# EasyEDA schematic LcdNodes-Building-Block-LocoNet-Interface.json
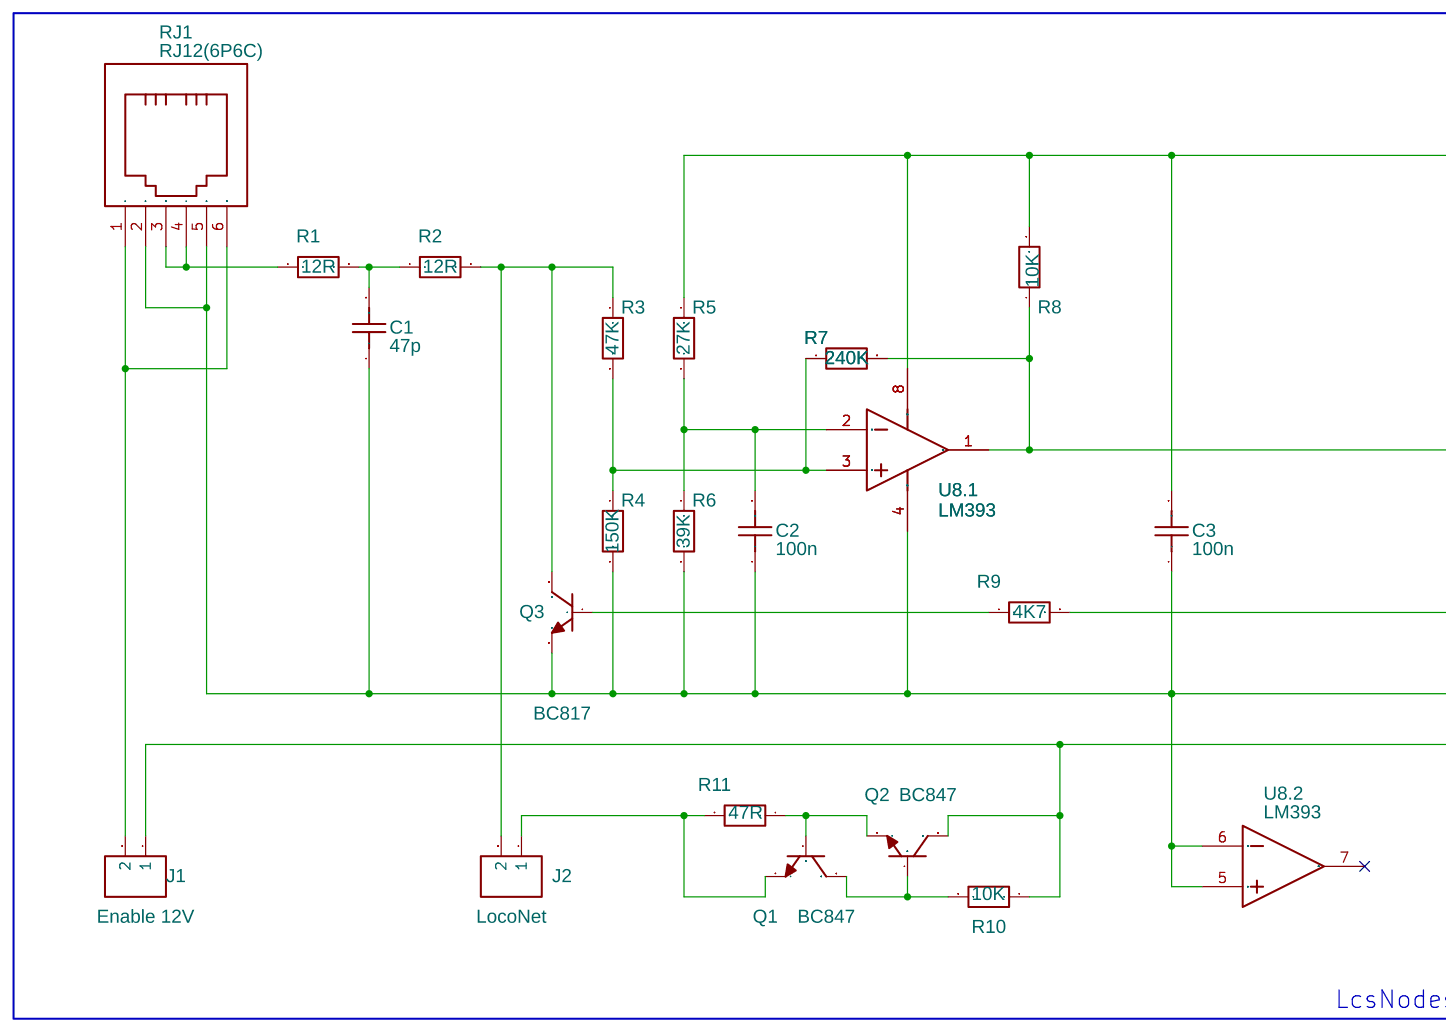
[diagram p0: schematic sheet]

## Parts
C1  47p  [C1206]
C2  100n  [C1206]
C3  100n  [C1206]
J1  Enable 12V  [HDR-M-2.54_1X2]
J2  LocoNet  [HDR-M-2.54_1X2]
Q1  BC847  [SOT-323-3_L2.0-W1.3-P1.30-LS2.1-BR]
Q2  BC847  [SOT-323-3_L2.0-W1.3-P1.30-LS2.1-BR]
Q3  BC817  [SOT-23-3_L2.9-W1.3-P1.90-LS2.4-BR]
R1  12R  [R1206]
R2  12R  [R1206]
R3  47K  [R1206]
R4  150K  [R1206]
R5  27K  [R1206]
R6  39K  [R1206]
R7  240K  [R1206]
R8  10K  [R1206]
R9  4K7  [R1206]
R10  10K  [R1206]
R11  47R  [R1206]
RJ1  RJ12(6P6C)  [RJ12-TH_6P6C]
U8  LM393  [SOIC-8_L4.9-W3.9-P1.27-LS6.0-BL]  (sections 1,2)

## Library data of the parts
C1-C3 = CT41G-1206-X5R-50V-10UF-M(N): Supplier: LCSC; Supplier Part: C9900007291; Manufacturer: null; Manufacturer Part: CT41G-1206-X5R-50V-10uF-M(N); link: https://atta.szlcsc.comnull; JLCPCB Part Class: Extended Part; Contributor: lcsc
J1 J2 = HDR-M-2.54_1x2: Supplier Part: C124375; Supplier: LCSC; Contributor: LCEDA_Lib
Q1 Q2 = BC847CW-QBC847CW-QXX: Supplier: LCSC; Supplier Part: C5182829; Manufacturer: Nexperia(安世); link: https://atta.szlcsc.com/upload/public/pdf/source/20220920/079F28AA67300DB8DEDEEFA28BB33B43.pdf; Contributor: lcsc; JLCPCB Part Class: Extended Part
Q3 = BC817-40: Supplier: LCSC; Manufacturer: Hottech(合科泰); Contributor: LCSC; Supplier Part: C181151; JLCPCB Part Class: Extended Part
R1-R11 = HVF1206T5002FET: Supplier: LCSC; Supplier Part: C4087637; Manufacturer: Ohmite; link: https://atta.szlcsc.comnull; Contributor: lcsc
RJ1 = RJ12(6P6C): Contributor: yulin0826
U8 = LM393ADRE4: Supplier: LCSC; Supplier Part: C3659061; Manufacturer: TI(德州仪器); link: https://atta.szlcsc.com/upload/public/pdf/source/20230221/4AD22C75DCC6447290BC7CE521BA2EAE.pdf; subpart_no: 1

## Nets
GND: C1.1 C2.1 C3.1 Q3.2 R4.2 R6.2 RJ1.2 RJ1.5 U8.4(GND) U8.5(2IN+) U8.6(2IN-)
VCC: C3.2 R5.1 R8.2 U8.8(VDD)
VCC-12V: J1.1 Q2.3(C) R10.1
RX: R7.2 R8.1 U8.1(1OUT)
TX: R9.2
Net-(C1-2): C1.2 R1.2 R2.1
Net-(C2-2): C2.2 R5.2 R6.1 U8.2(1IN-)
Net-(J1-2): J1.2 RJ1.1 RJ1.6
Net-(J2-1): J2.1 Q1.2(E) R11.2
Net-(J2-2): J2.2 Q3.3 R2.2 R3.1
Net-(Q1-1): Q1.1(B) Q2.2(E) R11.1
Net-(Q1-3): Q1.3(C) Q2.1(B) R10.2
Net-(Q3-1): Q3.1 R9.1
Net-(R1-1): R1.1 RJ1.3 RJ1.4
Net-(R3-2): R3.2 R4.1 R7.1 U8.3(1IN+)

Not connected (* = marked no-connect by the designer): U8 7(2OUT)*

## Notes on the sheet
- LcsNodes-LocoNet-Interface
